# EAGLE design Buffer or Inverter (EAGLE 5.11)
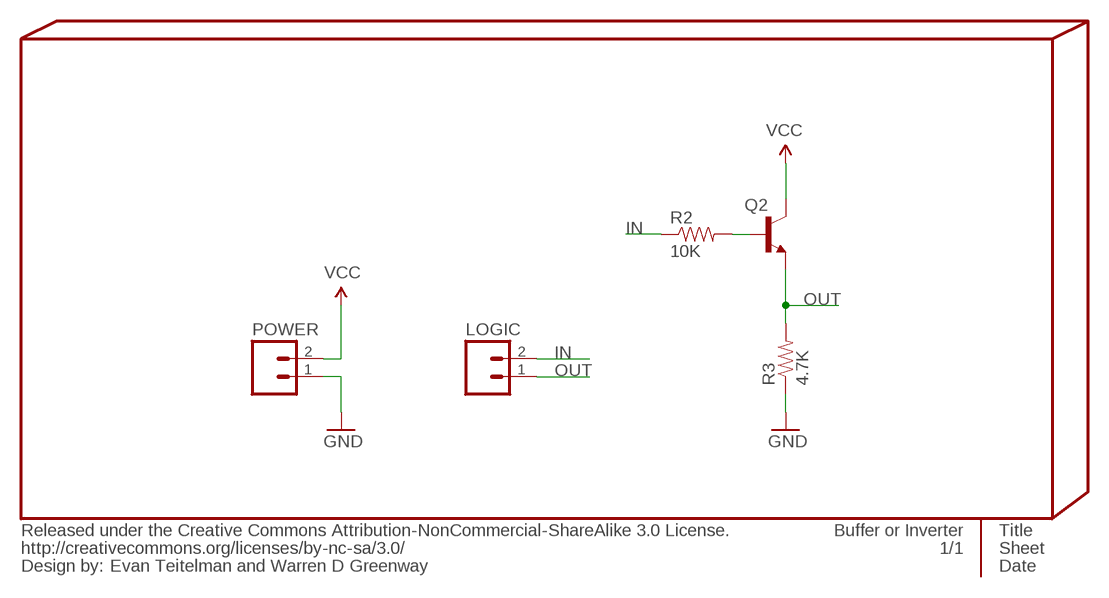
[diagram p0: schematic, sheet 1]

## Parts
INFO4  Evan Teitelman and Warren D Greenway  %CC-NC-SA  [%CC-NC-SA]
LOGIC  M02PTH  [1X02]
POWER  M02PTH  [1X02]
Q2  TRANSISTOR_NPNSOT23  [SOT23]
R2  10K  RESISTOR0402-RES  [0402-RES]
R3  4.7K  RESISTOR0402-RES  [0402-RES]

## Nets
GND: POWER.1 R3.1 ; supply symbol labelled @GND
IN: LOGIC.2 R2.1
N$4: Q2.1(B) R2.2
OUT: LOGIC.1 Q2.2(E) R3.2
VCC: POWER.2 Q2.3(C) ; supply symbol labelled @VCC

## Library data of the parts
INFO4 = PygmyBoards:%CC-NC-SA: Released under the Creative Commons Attribution-NonCommercial-ShareAlike 3.0 License. http://creativecommons.org/licenses/by-sa/3.0 Design by: [Designer Name] Change this part's value to change the designer name
LOGIC POWER = SparkFun:M02: Header 2 Standard 2-pin 0.1" header. Use with straight break away headers (SKU : PRT-00116), right angle break away headers (PRT-00553), swiss pins (PRT-00743), machine pins (PRT-00117), and female headers (PRT-00115). Molex polarized connector foot print use with SKU : PRT-08233 with associated crimp pins and housings.
Q2 = SparkFun:TRANSISTOR_NPN: Transistor NPN BJT configuration in SOT23 package. MMBT2222 is the common NPN we use. Double check BCE configuration again layout.
R2 R3 = SparkFun:RESISTOR: Resistor Basic schematic elements and footprints for 0603, 1206, and PTH resistors.

## Board
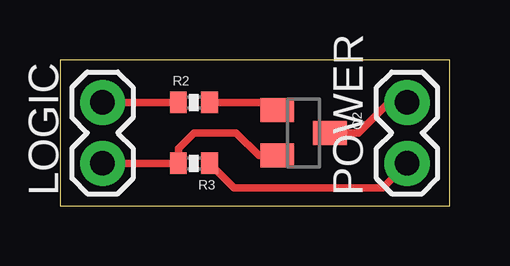
[diagram p1: board, top side]

Size 16.26 x 6.1 mm. Coordinates in mm from the lower left corner, seen from the top.
Outline: 0,0 16.26,0 16.26,6.1 0,6.1 0,0
Copper layers (1*16): Top 0.035mm / dielectric 1.5mm / Bottom 0.035mm
Design rules "PDX (Production)": minimum track width 6mil, minimum drill 13mil, track to track 6mil, track to pad 6mil, pad to pad 4mil, via to via 6mil, smd to smd 4mil, copper to edge 15mil, drill to drill 6mil, minimum pad ring 10mil, minimum via ring 8mil, stop-mask expansion 4mil, vias tented up to drill 25mil, thermal gap 10mil

### Footprints (pad centres in the part's own frame; a part is rotated, then mirrored left to right if it is on the bottom)
1X02 = drill 1.016 pad 1.88 round: 1 0,0; 2 2.54,0
SOT23 = smd 1 x 1.4: 1 -0.95,-1.1; 2 0.95,-1.1; 3 0,1.1
0402-RES = smd 0.7 x 0.9: 1 -0.65,0; 2 0.65,0

### Placement (x,y rotation side)
INFO4  0,-7.62 0 top  (outside the outline)
LOGIC  1.78,1.78 90 top
POWER  14.48,1.78 90 top
Q2  10.16,3.05 270 top
R2  5.59,4.32 0 top
R3  5.59,1.78 180 top

### Tracks (layer width: path | path; a pad name or v marks a point on that pad's centre or on a via)
GND
  Top 0.305: R3.1 7.25,0.76 13.46,0.76 POWER.1
IN
  Top 0.305: LOGIC.2 R2.1
N$4
  Top 0.305: R2.2 8.74,4.32 Q2.1
OUT
  Top 0.305: LOGIC.1 R3.2 4.94,2.4 5.59,3.05 7.35,3.05 8.3,2.1 Q2.2
VCC
  Top 0.305: Q2.3 12.45,3.05 13.72,4.32 POWER.2

### Text on the board
_bsilk: AND | Out | In-B | Gnd | In-A | Vcc